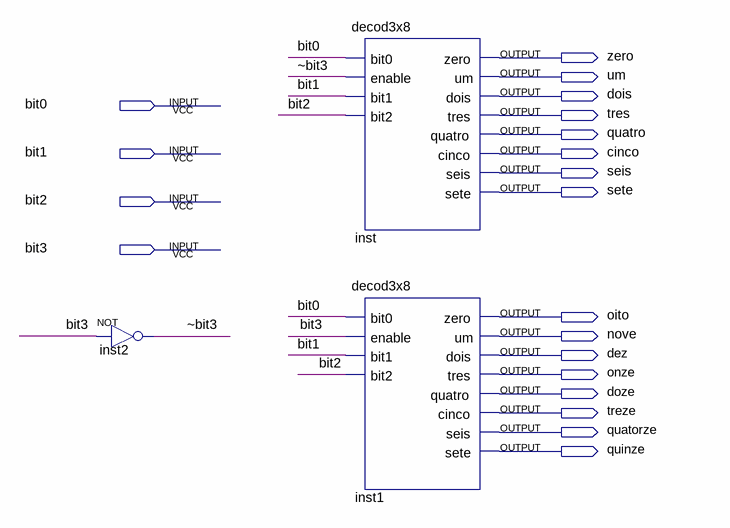
[diagram p0: schematic sheet]
// Quartus schematic decod4x16.bdf as structural Verilog: 3 symbols, 20 pins
module decod4x16 (
  input  bit0,
  input  bit1,
  input  bit2,
  input  bit3,
  output zero,
  output um,
  output dois,
  output tres,
  output quatro,
  output cinco,
  output seis,
  output sete,
  output oito,
  output nove,
  output dez,
  output onze,
  output doze,
  output treze,
  output quatorze,
  output quinze
);

  wire \~bit3 ;

  not inst2 (\~bit3 , bit3);
  decod3x8 inst (
    .bit0(bit0), .enable(\~bit3 ), .bit1(bit1), .bit2(bit2), .zero(zero), .um(um), .dois(dois), .tres(tres),
    .quatro(quatro), .cinco(cinco), .seis(seis), .sete(sete));
  decod3x8 inst1 (
    .bit0(bit0), .enable(bit3), .bit1(bit1), .bit2(bit2), .zero(oito), .um(nove), .dois(dez), .tres(onze),
    .quatro(doze), .cinco(treze), .seis(quatorze), .sete(quinze));
endmodule
